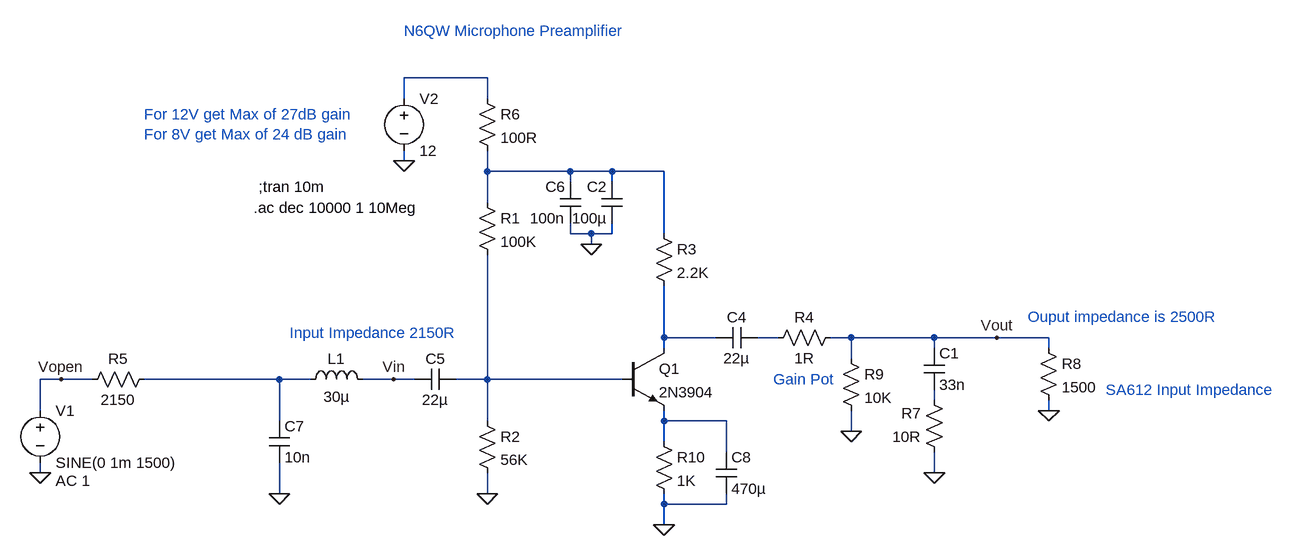
[diagram p0: schematic Mic Preamp (N6QW).asc]
Mic Preamp (N6QW).asc, the LTspice schematic file:
Version 4
SHEET 1 1276 680
WIRE -48 -288 -176 -288
WIRE -176 -256 -176 -288
WIRE -48 -256 -48 -288
WIRE -176 -160 -176 -176
WIRE -48 -144 -48 -176
WIRE 80 -144 -48 -144
WIRE 144 -144 80 -144
WIRE 224 -144 144 -144
WIRE 80 -128 80 -144
WIRE 144 -128 144 -144
WIRE -48 -96 -48 -144
WIRE 80 -48 80 -64
WIRE 112 -48 80 -48
WIRE 144 -48 144 -64
WIRE 144 -48 112 -48
WIRE 224 -48 224 -144
WIRE 112 -32 112 -48
WIRE 224 112 224 32
WIRE 304 112 224 112
WIRE 400 112 368 112
WIRE 512 112 480 112
WIRE 640 112 512 112
WIRE 736 112 640 112
WIRE 816 112 736 112
WIRE 224 128 224 112
WIRE 640 128 640 112
WIRE 816 128 816 112
WIRE 512 144 512 112
WIRE -704 176 -736 176
WIRE -656 176 -704 176
WIRE -368 176 -576 176
WIRE -320 176 -368 176
WIRE -192 176 -240 176
WIRE -160 176 -192 176
WIRE -48 176 -48 -16
WIRE -48 176 -96 176
WIRE 160 176 -48 176
WIRE 640 208 640 192
WIRE -736 224 -736 176
WIRE 816 224 816 208
WIRE -368 240 -368 176
WIRE -48 240 -48 176
WIRE 224 240 224 224
WIRE 320 240 224 240
WIRE 512 256 512 224
WIRE 224 272 224 240
WIRE 320 288 320 240
WIRE -736 320 -736 304
WIRE 640 320 640 288
WIRE -368 352 -368 304
WIRE -48 352 -48 320
WIRE 224 368 224 352
WIRE 320 368 320 352
WIRE 320 368 224 368
WIRE 224 400 224 368
FLAG -176 -160 0
FLAG -736 320 0
FLAG 224 400 0
FLAG 112 -32 0
FLAG 640 320 0
FLAG -704 176 Vopen
FLAG -192 176 Vin
FLAG 816 224 0
FLAG 736 112 Vout
FLAG 512 256 0
FLAG -368 352 0
FLAG -48 352 0
SYMBOL npn 160 128 R0
SYMATTR InstName Q1
SYMATTR Value 2N3904
SYMBOL res -64 -112 R0
SYMATTR InstName R1
SYMATTR Value 100K
SYMBOL res 208 -64 R0
SYMATTR InstName R3
SYMATTR Value 2.2K
SYMBOL cap 160 -64 R180
WINDOW 0 24 56 Left 2
WINDOW 3 24 8 Left 2
SYMATTR InstName C2
SYMATTR Value 100µ
SYMBOL voltage -736 208 R0
WINDOW 123 24 124 Left 2
WINDOW 39 0 0 Left 2
SYMATTR Value2 AC 1
SYMATTR InstName V1
SYMATTR Value SINE(0 1m 1500)
SYMBOL voltage -176 -272 R0
WINDOW 123 0 0 Left 2
WINDOW 39 0 0 Left 2
SYMATTR InstName V2
SYMATTR Value 12
SYMBOL res -560 160 R90
WINDOW 0 0 56 VBottom 2
WINDOW 3 32 56 VTop 2
SYMATTR InstName R5
SYMATTR Value 2150
SYMBOL res -64 -272 R0
SYMATTR InstName R6
SYMATTR Value 100R
SYMBOL cap 368 96 R90
WINDOW 0 0 32 VBottom 2
WINDOW 3 32 32 VTop 2
SYMATTR InstName C4
SYMATTR Value 22µ
SYMBOL res 656 304 R180
WINDOW 0 36 76 Left 2
WINDOW 3 36 40 Left 2
SYMATTR InstName R7
SYMATTR Value 10R
SYMBOL res 800 112 R0
SYMATTR InstName R8
SYMATTR Value 1500
SYMBOL cap 96 -64 R180
WINDOW 0 24 56 Left 2
WINDOW 3 24 8 Left 2
SYMATTR InstName C6
SYMATTR Value 100n
SYMBOL cap 624 128 R0
SYMATTR InstName C1
SYMATTR Value 33n
SYMBOL cap -160 160 M90
WINDOW 0 0 32 VBottom 2
WINDOW 3 32 32 VTop 2
SYMATTR InstName C5
SYMATTR Value 22µ
SYMBOL res 496 96 R90
WINDOW 0 0 56 VBottom 2
WINDOW 3 32 56 VTop 2
SYMATTR InstName R4
SYMATTR Value 1R
SYMBOL res 496 128 R0
SYMATTR InstName R9
SYMATTR Value 10K
SYMBOL cap -384 240 R0
SYMATTR InstName C7
SYMATTR Value 10n
SYMBOL ind -336 192 R270
WINDOW 0 32 56 VTop 2
WINDOW 3 5 56 VBottom 2
SYMATTR InstName L1
SYMATTR Value 30µ
SYMBOL res -64 224 R0
SYMATTR InstName R2
SYMATTR Value 56K
SYMBOL res 208 256 R0
SYMATTR InstName R10
SYMATTR Value 1K
SYMBOL cap 304 288 R0
SYMATTR InstName C8
SYMATTR Value 470µ
TEXT -400 -120 Left 2 !;tran 10m
TEXT 904 192 Left 2 ;SA612 Input Impedance
TEXT -352 104 Left 2 ;Input Impedance 2150R
TEXT 784 80 Left 2 ;Ouput impedance is 2500R
TEXT 392 176 Left 2 ;Gain Pot
TEXT -576 -232 Left 2 ;For 12V get Max of 27dB gain\nFor 8V get Max of 24 dB gain
TEXT -176 -360 Left 2 ;N6QW Microphone Preamplifier
TEXT -408 -88 Left 2 !.ac dec 10000 1 10Meg

The netlist it stands for:
* Mic Preamp (N6QW).asc
Q1 N003 N006 N008 0 2N3904
R1 N002 N006 100K
R3 N002 N003 2.2K
C2 0 N002 100µ
V1 Vopen 0 SINE(0 1m 1500) AC 1
V2 N001 0 12
R5 N005 Vopen 2150
R6 N001 N002 100R
C4 N004 N003 22µ
R7 0 N007 10R
R8 Vout 0 1500
C6 0 N002 100n
C1 Vout N007 33n
C5 Vin N006 22µ
R4 Vout N004 1R
R9 Vout 0 10K
C7 N005 0 10n
L1 N005 Vin 30µ
R2 N006 0 56K
R10 N008 0 1K
C8 N008 0 470µ
.model NPN NPN
.model PNP PNP
.lib standard.bjt
;tran 10m
* SA612 Input Impedance
* Input Impedance 2150R
* Ouput impedance is 2500R
* Gain Pot
* For 12V get Max of 27dB gain
* For 8V get Max of 24 dB gain
* N6QW Microphone Preamplifier
.ac dec 10000 1 10Meg
.backanno
.end